# Altium project Kasli-DIOT.PrjPCB (part 6 of 7)

## Sheet CLK_buffer_DRTIO_CDR.SchDoc: Kasli-DIOT
size 420 x 297 mm; EDA_Number: EDA-04514-V3-0; Projet: DI/OT System Board; Author: G.Kasprowicz; CompanyName: WUT ISE; DrawnBy: F.Świtakowski; Organization: WUT ISE; Address1: PW ISE; Address2: Nowowiejska 15/19 00-665 Warsaw; Address3: gkasprow@gmail.com; DocumentNumber: 15; Revision: 1.0; SheetNumber: 12; SheetTotal: 16; ModifiedBy: -; CheckedDate: -; Title2: CLK buffer DRTIo; DivGrp: WUT ISE; Designer: F.Świtakowski; ModifiedDate: -; ProjectName: Sensor Box
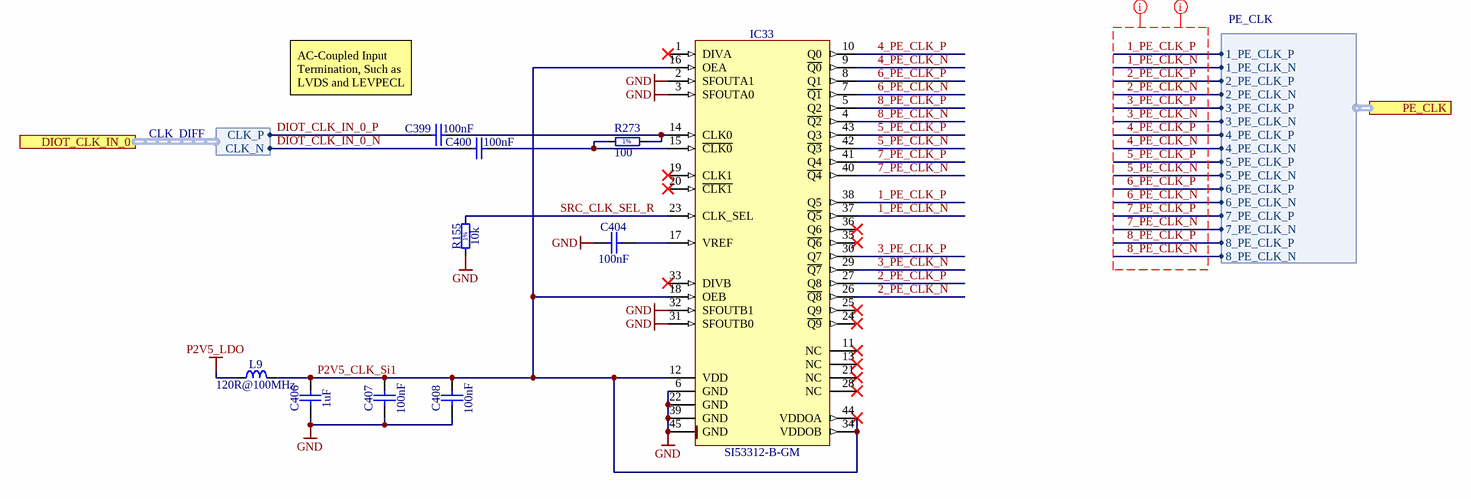
[diagram p8: CLK_buffer_DRTIO_CDR.SchDoc]

### Parts
C399  100nF  [CAPC0603X33N]
C400  100nF  [CAPC0603X33N]
C404  100nF  [CAPC1005X55N]
C406  1uF  [CAPC1608X87N]
C407  100nF  [CAPC1005X55N]
C408  100nF  [CAPC1005X55N]
IC33  SI53312-B-GM  [QFN50P700X700X90-45N-S295]
L9  120R@100MHz  [INDC1608X95N]
R155  10k  [RESC1005X40N]
R273  100  [RESC1005X40N]

### Ports
DIOT_CLK_IN_0 (harness CLK_DIFF), PE_CLK (harness PE_CLK)

### Harnesses
PE_CLK: 1_PE_CLK_P, 1_PE_CLK_N, 2_PE_CLK_P, 2_PE_CLK_N, 3_PE_CLK_P, 3_PE_CLK_N, 4_PE_CLK_P, 4_PE_CLK_N, 5_PE_CLK_P, 5_PE_CLK_N, 6_PE_CLK_P, 6_PE_CLK_N, 7_PE_CLK_P, 7_PE_CLK_N, 8_PE_CLK_P, 8_PE_CLK_N
CLK_DIFF: CLK_P, CLK_N

### Nets
GND: C404.1 C406.1 C407.1 C408.1 IC33.2(SFOUTA1) IC33.3(SFOUTA0) IC33.6(GND) IC33.22(GND) IC33.31(SFOUTB0) IC33.32(SFOUTB1) IC33.39(GND) IC33.45(GND) R155.1
P2V5_LDO: L9.2
1_PE_CLK_N: IC33.37(~{Q5}) ; port PE_CLK.1_PE_CLK_N
1_PE_CLK_P: IC33.38(Q5) ; port PE_CLK.1_PE_CLK_P
2_PE_CLK_N: IC33.26(~{Q8}) ; port PE_CLK.2_PE_CLK_N
2_PE_CLK_P: IC33.27(Q8) ; port PE_CLK.2_PE_CLK_P
3_PE_CLK_N: IC33.29(~{Q7}) ; port PE_CLK.3_PE_CLK_N
3_PE_CLK_P: IC33.30(Q7) ; port PE_CLK.3_PE_CLK_P
4_PE_CLK_N: IC33.9(~{Q0}) ; port PE_CLK.4_PE_CLK_N
4_PE_CLK_P: IC33.10(Q0) ; port PE_CLK.4_PE_CLK_P
5_PE_CLK_N: IC33.42(~{Q3}) ; port PE_CLK.5_PE_CLK_N
5_PE_CLK_P: IC33.43(Q3) ; port PE_CLK.5_PE_CLK_P
6_PE_CLK_N: IC33.7(~{Q1}) ; port PE_CLK.6_PE_CLK_N
6_PE_CLK_P: IC33.8(Q1) ; port PE_CLK.6_PE_CLK_P
7_PE_CLK_N: IC33.40(~{Q4}) ; port PE_CLK.7_PE_CLK_N
7_PE_CLK_P: IC33.41(Q4) ; port PE_CLK.7_PE_CLK_P
8_PE_CLK_N: IC33.4(~{Q2}) ; port PE_CLK.8_PE_CLK_N
8_PE_CLK_P: IC33.5(Q2) ; port PE_CLK.8_PE_CLK_P
DIOT_CLK_IN_0_N: C400.1 ; port DIOT_CLK_IN_0.CLK_N  [project net DIOT_CLK_IN_0.CLK_N]
DIOT_CLK_IN_0_P: C399.1 ; port DIOT_CLK_IN_0.CLK_P  [project net DIOT_CLK_IN_0.CLK_P]
P2V5_CLK_Si1: C406.2 C407.2 C408.2 IC33.12(VDD) IC33.16(OEA) IC33.18(OEB) IC33.34(VDDOB) IC33.44(VDDOA) L9.1
SRC_CLK_SEL_R: IC33.23(CLK_SEL) R155.2
NetC399_2: C399.2 IC33.14(CLK0) R273.2
NetC400_2: C400.2 IC33.15(~{CLK0}) R273.1
NetC404_2: C404.2 IC33.17(VREF)

Not connected (* = marked no-connect by the designer): IC33 1(DIVA)* 11(NC)* 13(NC)* 19(CLK1)* 20(~{CLK1})* 21(NC)* 24(~{Q9})* 25(Q9)* 28(NC)* 33(DIVB)* 35(~{Q6})* 36(Q6)*

### Layout directives
net class D100: 1_PE_CLK_N, 1_PE_CLK_P, 2_PE_CLK_N, 2_PE_CLK_P, 3_PE_CLK_N, 3_PE_CLK_P, 4_PE_CLK_N, 4_PE_CLK_P, 5_PE_CLK_N, 5_PE_CLK_P, 6_PE_CLK_N, 6_PE_CLK_P, 7_PE_CLK_N, 7_PE_CLK_P, 8_PE_CLK_N, 8_PE_CLK_P
net class PE_CLK: 1_PE_CLK_N, 1_PE_CLK_P, 2_PE_CLK_N, 2_PE_CLK_P, 3_PE_CLK_N, 3_PE_CLK_P, 4_PE_CLK_N, 4_PE_CLK_P, 5_PE_CLK_N, 5_PE_CLK_P, 6_PE_CLK_N, 6_PE_CLK_P, 7_PE_CLK_N, 7_PE_CLK_P, 8_PE_CLK_N, 8_PE_CLK_P

### Notes on the sheet
- (near C399) AC-Coupled Input Termination, Such as LVDS and LEVPECL
- Project/Equipment
- Document
- Designer
- Drawn by
- Check.by
- Copyright WUT ISE 2024.
  This documentation describes Open Hardware and is licensed under the CERN OHL-W v.2.0. You may redistribute and modify this documentation under the terms of the CERN OHL-W v.2.0. (http://ohwr.org/CERNOHL). This documentation is distributed WITHOUT ANY EXPRESS OR IMPLIED WARRANTY, INCLUDING OF MERCHANTABILITY, SATISFACTORY QUALITY AND FITNESS FOR A PARTICULAR PURPOSE. Please see the CERN OHL v.2.0 for applicable conditions.
- Contact
- File
- Last Mod.
- Print Date
- Sheet
- Size
- A3
- of
- Rev
- (in symbol R0402_10K_1%_0.0625W_100PPM) 1%
- (in symbol R0402_100R_1%_0.0625W_100PPM) 1%

### Library data of the parts
C399 C400 = CC0201_100NF_6.3V_10%_X5R: Non-polarised capacitor; Part Description: SMD Multilayer Chip Ceramic Capacitor; Manufacturer: GENERIC; Manufacturer1 Part Number: 02016D104KAT2A; Voltage: 6.3V; TC: X5R; Tolerance: ±10%; Part Number: CC0201_100NF_6.3V_10%_X5R; Component Kind: Standard; Component Type: Standard; Pin Count: 2; Value: 100nF; Status: Not Recommended; Manufacturer Part Number: CC0201_100NF_6.3V_10%_X5R; Case: 0201; Mounted: Yes; Socket: No; SMD: Yes; Sense: No; Manufacturer1 Example: AVX; Manufacturer1 ComponentHeight: 0.33mm; HelpURL: \\cern.ch\dfs\Applications\Altium\Datasheets\CC0201_X5R_AVX.pdf; Author: CERN DEM JLC; CreateDate: 03.12.2007; LatestRevisionDate: 03.12.2007
C404 C407 C408 = CC0402_100NF_16V_10%_X7R: as C213-C224 on sheet USB_Serial_Quad; Part Number: CC0402_100NF_16V_10%_X7R; Component Kind: Standard; Component Type: Standard; Pin Count: 2; Value: 100nF; Status: Not Recommended; Manufacturer Part Number: CC0402_100NF_16V_10%_X7R; Case: 0402; Mounted: Yes; Socket: No; SMD: Yes; Sense: No; Manufacturer1 Example: MURATA; Manufacturer1 ComponentHeight: 0.55mm; HelpURL: \\cern.ch\dfs\Applications\Altium\Datasheets\CC0402_X7R_MURATA_GRM.pdf; Author: CERN DEM JLC; CreateDate: 05/12/2013; LatestRevisionDate: 03/12/2007
C406 = CC0603_1UF_25V_10%_X7R: Non-polarised capacitor; Part Description: SMD Multilayer Chip Ceramic Capacitor; Manufacturer: GENERIC; Manufacturer1 Part Number: GRM188R71E105KA12D; Voltage: 25V; TC: X7R; Tolerance: ±10%; Part Number: CC0603_1UF_25V_10%_X7R; Component Kind: Standard; Component Type: Standard; Pin Count: 2; Value: 1uF; Status: None; Manufacturer Part Number: CC0603_1UF_25V_10%_X7R; Case: 0603; Mounted: Yes; Socket: No; SMD: Yes; Sense: No; Manufacturer1 Example: MURATA; Manufacturer1 ComponentHeight: 0.9mm; HelpURL: \\cern.ch\dfs\Applications\Altium\Datasheets\CC0603_X7R_MURATA.pdf; Author: CERN DEM JLC; CreateDate: 18.01.2011; LatestRevisionDate: 18.01.2011
IC33 = SI53312-B-GM: 2 Input/10 Output, Low Jitter Universal Buffer/Level Translator With 2:1 Input Mux (<1.25 GHZ); Manufacturer: SILICON LABS; PressFit: No; Bonding: No; Part Number: SI53312-B-GM; Component Kind: Standard; Component Type: Standard; Device: SI53312-B-GM; PackageDescription: QFN, 0.50mm Pitch, Square; 44 Pin, 7.00mm L X 7.00mm W X 0.90mm H body (w/Thermal Tab 2.95 X 2.95mm), IPC Medium Density; Part Description: 2 Input/10 Output, Low Jitter Universal Buffer/Level Translator With 2:1 Input Mux (<1.25 GHZ); Manufacturer Part Number: SI53312-B-GM; Pin Count: 45; Case: QFN44; Mounted: Yes; Socket: No; SMD: Yes; Sense: No; ComponentHeight: 0.9mm; Author: CERN DEM MR; HelpURL: \\cern.ch\dfs\Applications\Altium\Datasheets\SI53312-B-GM.pdf; CreateDate: 02.10.2017; LatestRevisionDate: 02.10.2017
L9 = IND0603_MURATA_BLM18PG121SN1D: Inductor; Part Description: SMD EMIFIL Chip Ferrite Bead; Manufacturer: MURATA; Power: 2A; Resistance: 0.05R; Part Number: IND0603_MURATA_BLM18PG121SN1D; Component Kind: Standard; Component Type: Standard; Pin Count: 2; Value: 120R@100MHz; Status: None; Manufacturer Part Number: BLM18PG121SN1D; Case: 0603; Mounted: Yes; Socket: No; SMD: Yes; Sense: No; ComponentHeight: 0.95mm; HelpURL: \\cern.ch\dfs\Applications\Altium\Datasheets\IND0603_MURATA_BLM18P.pdf; Author: CERN DEM BC; CreateDate: 2015-07-27; LatestRevisionDate: 2015-07-27
R155 = R0402_10K_1%_0.0625W_100PPM: as R194-R198 on sheet USB_Serial_Quad; Part Number: R0402_10K_1%_0.0625W_100PPM; Component Kind: Standard; Component Type: Standard; Pin Count: 2; Value: 10k; Status: Not Recommended; Power: 0.0625W; Tolerance: ±1%; Manufacturer Part Number: R0402_10K_1%_0.0625W_100PPM; Case: 0402; Mounted: Yes; Sense: No; Socket: No; SMD: Yes; Manufacturer1 Example: YAGEO PHYCOMP; Manufacturer1 ComponentHeight: 0.4mm; HelpURL: \\cern.ch\dfs\Applications\Altium\Datasheets\R0402_Phycomp_RC0402.pdf; Author: CERN DEM JLC; CreateDate: 03.12.2007; LatestRevisionDate: 17.10.2012
R273 = R0402_100R_1%_0.0625W_100PPM: Resistor - 1%; Part Description: General Purpose Thick Film Chip Resistor; Manufacturer: GENERIC; Manufacturer1 Part Number: 232270671001L; TC: ±100ppm/°C; PressFit: No; Part Number: R0402_100R_1%_0.0625W_100PPM; Component Kind: Standard; Component Type: Standard; Pin Count: 2; Value: 100; Status: Not Recommended; Power: 0.0625W; Tolerance: ±1%; Manufacturer Part Number: R0402_100R_1%_0.0625W_100PPM; Case: 0402; Mounted: Yes; Sense: No; Socket: No; SMD: Yes; Manufacturer1 Example: YAGEO PHYCOMP; Manufacturer1 ComponentHeight: 0.4mm; HelpURL: \\cern.ch\dfs\Applications\Altium\Datasheets\R0402_Phycomp_RC0402.pdf; Author: CERN DEM JLC; CreateDate: 03.12.2007; LatestRevisionDate: 17.10.2012

## Sheet Ext_conn.schdoc: Kasli-DIOT
size 420 x 297 mm; EDA_Number: ARTIQ; Projet: ARTIQ/SINARA; Author: G.Kasprowicz; CompanyName: WUT ISE; DrawnBy: F.Świtakowski; Organization: WUT ISE; Address1: PW ISE; Address2: Nowowiejska 15/19 00-665 Warsaw; Address3: gkasprow@gmail.com; DocumentNumber: 16; Revision: 1.0; SheetNumber: 13; SheetTotal: 16; ModifiedBy: -; CheckedDate: -; Title2: Ext conn; DivGrp: WUT ISE; Designer: F.Świtakowski; ModifiedDate: -; ProjectName: Sensor Box
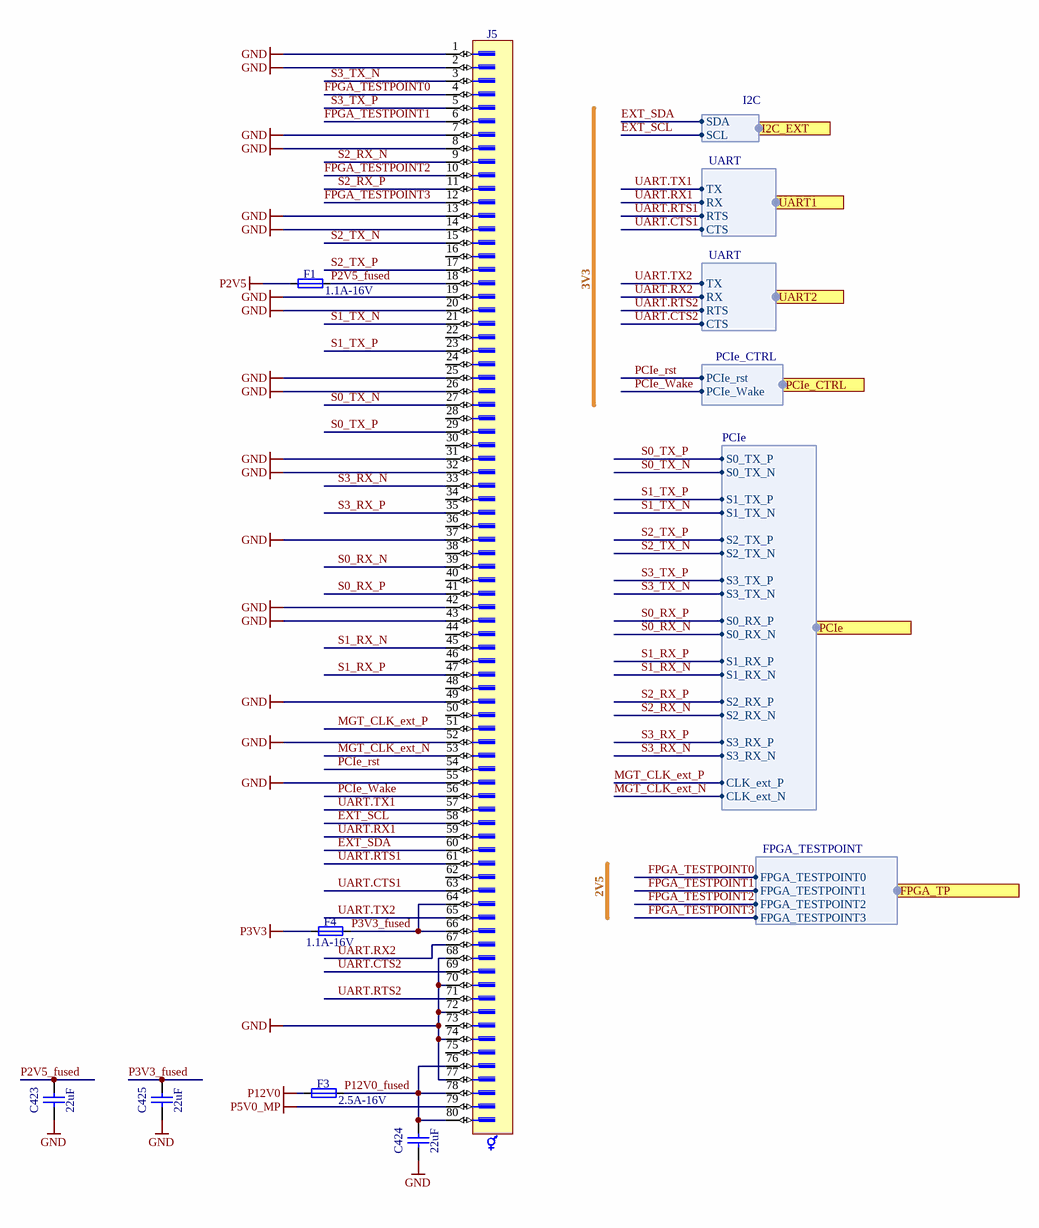
[diagram p9: Ext_conn.schdoc]

### Parts
C423  22uF  [CAPC2012X135N]
C424  22uF  [CAPC2012X135N]
C425  22uF  [CAPC2012X135N]
F1  1.1A-16V  [FUSR_BOURNS_MF-MSMF_STYLE1(H85)]
F3  2.5A-16V  [FUSR_BOURNS_MF-MSMF_STYLE2]
F4  1.1A-16V  [FUSR_BOURNS_MF-MSMF_STYLE1(H85)]
J5  (no value)  [SAMTEC_LSS-140-01-L-DV-A]

### Ports
FPGA_TP (harness FPGA_TESTPOINT), I2C_EXT (harness i2C), PCIe (harness PCIe), PCIe_CTRL (harness PCIe_CTRL), UART1 (harness UART), UART2 (harness UART)

### Harnesses
UART: TX, RX, RTS, CTS
PCIe_CTRL: PCIe_rst, PCIe_Wake
PCIe: S0_TX_P, S0_TX_N, S1_TX_P, S1_TX_N, S2_TX_P, S2_TX_N, S3_TX_P, S3_TX_N, S0_RX_P, S0_RX_N, S1_RX_P, S1_RX_N, S2_RX_P, S2_RX_N, S3_RX_P, S3_RX_N, CLK_ext_P, CLK_ext_N
FPGA_TESTPOINT: FPGA_TESTPOINT0, FPGA_TESTPOINT1, FPGA_TESTPOINT2, FPGA_TESTPOINT3
I2C: SDA, SCL

### Nets
GND: C423.1 C424.1 C425.1 J5.1 J5.2 J5.7 J5.8 J5.13 J5.14 J5.19 J5.20 J5.25 J5.26 J5.31 J5.32 J5.37 J5.42 J5.43 J5.49 J5.52 J5.55 J5.68 J5.70 J5.72 J5.74 J5.77
P2V5: F1.1
P3V3: F4.1
P5V0_MP: J5.79
P12V0: F3.1
EXT_SCL: J5.58 ; port I2C_EXT.SCL
EXT_SDA: J5.60 ; port I2C_EXT.SDA
FPGA_TESTPOINT0: J5.4 ; port FPGA_TP.FPGA_TESTPOINT0
FPGA_TESTPOINT1: J5.6 ; port FPGA_TP.FPGA_TESTPOINT1
FPGA_TESTPOINT2: J5.10 ; port FPGA_TP.FPGA_TESTPOINT2
FPGA_TESTPOINT3: J5.12 ; port FPGA_TP.FPGA_TESTPOINT3
MGT_CLK_ext_N: J5.53 ; port PCIe.CLK_ext_N
MGT_CLK_ext_P: J5.51 ; port PCIe.CLK_ext_P
P2V5_fused: C423.2 F1.2 J5.18
P3V3_fused: C425.2 F4.2 J5.64 J5.66
P12V0_fused: C424.2 F3.2 J5.76 J5.78 J5.80
PCIe_rst: J5.54 ; port PCIe_CTRL.PCIe_rst
PCIe_Wake: J5.56 ; port PCIe_CTRL.PCIe_Wake
S0_RX_N: J5.39 ; port PCIe.S0_RX_N
S0_RX_P: J5.41 ; port PCIe.S0_RX_P
S0_TX_N: J5.27 ; port PCIe.S0_TX_N
S0_TX_P: J5.29 ; port PCIe.S0_TX_P
S1_RX_N: J5.45 ; port PCIe.S1_RX_N
S1_RX_P: J5.47 ; port PCIe.S1_RX_P
S1_TX_N: J5.21 ; port PCIe.S1_TX_N
S1_TX_P: J5.23 ; port PCIe.S1_TX_P
S2_RX_N: J5.9 ; port PCIe.S2_RX_N
S2_RX_P: J5.11 ; port PCIe.S2_RX_P
S2_TX_N: J5.15 ; port PCIe.S2_TX_N
S2_TX_P: J5.17 ; port PCIe.S2_TX_P
S3_RX_N: J5.33 ; port PCIe.S3_RX_N
S3_RX_P: J5.35 ; port PCIe.S3_RX_P
S3_TX_N: J5.3 ; port PCIe.S3_TX_N
S3_TX_P: J5.5 ; port PCIe.S3_TX_P
UART.CTS1: J5.63 ; port UART1.CTS
UART.CTS2: J5.69 ; port UART2.CTS
UART.RTS1: J5.61 ; port UART1.RTS
UART.RTS2: J5.71 ; port UART2.RTS
UART.RX1: J5.59 ; port UART1.RX
UART.RX2: J5.67 ; port UART2.RX
UART.TX1: J5.57 ; port UART1.TX
UART.TX2: J5.65 ; port UART2.TX

Not connected (* = marked no-connect by the designer): J5 16 22 24 28 30 34 36 38 40 44 46 48 50 62 73 75

### Notes on the sheet
- 3V3
- 2V5
- Project/Equipment
- Document
- Designer
- Drawn by
- Check.by
- Copyright WUT ISE 2024.
  This documentation describes Open Hardware and is licensed under the CERN OHL-W v.2.0. You may redistribute and modify this documentation under the terms of the CERN OHL-W v.2.0. (http://ohwr.org/CERNOHL). This documentation is distributed WITHOUT ANY EXPRESS OR IMPLIED WARRANTY, INCLUDING OF MERCHANTABILITY, SATISFACTORY QUALITY AND FITNESS FOR A PARTICULAR PURPOSE. Please see the CERN OHL v.2.0 for applicable conditions.
- Contact
- File
- Last Mod.
- Print Date
- Sheet
- Size
- A3
- of
- Rev

### Library data of the parts
C423-C425 = CC0805_22UF_16V_10%_X5R: Non-polarised capacitor; Manufacturer: GENERIC; Part Description: SMD Multilayer Chip Ceramic Capacitor; Manufacturer1 Part Number: C2012X5R1C226KT; Tolerance: ±10%; Voltage: 16V; TC: X5R; Manufacturer Part Number: CC0805_22UF_16V_10%_X5R; Part Number: CC0805_22UF_16V_10%_X5R; Value: 22uF; Component Kind: Standard; Component Type: Standard; Pin Count: 2; Status: Preferred; Case: 0805; Mounted: Yes; Socket: No; SMD: Yes; Sense: No; Manufacturer1 Example: TDK; Manufacturer1 ComponentHeight: 1.35mm; HelpURL: \\cern.ch\dfs\Applications\Altium\Datasheets\CC0805_X5R_TDK_C.pdf; Author: CERN DEM JLC; CreateDate: 25.10.2012; LatestRevisionDate: 25.10.2012
F1 F4 = FUSR_BOURNS_MF-MSMF110/16-2: Fuse; Part Description: PTC Resettable Fuse; Manufacturer: BOURNS; PressFit: No; Part Number: FUSR_BOURNS_MF-MSMF110/16-2; Component Kind: Standard; Component Type: Standard; Pin Count: 2; PackageDescription: PTC Resettable Fuse, MF-MSMS Series, Case Style 1 Height 0.85mm; Family: Fuses Resettable; Mounted: Yes; Socket: No; SMD: Yes; Sense: No; Value: 1.1A-16V; Manufacturer Part Number: MF-MSMF110/16; ComponentHeight: 0.85mm; HelpURL: \\cern.ch\dfs\Applications\Altium\Datasheets\FUSR_BOURNS_MF-MSMF.pdf; Author: CERN DEM JLC; CreateDate: 02.03.2011; LatestRevisionDate: 20.06.2023
F3 = FUSR_BOURNS_MF-MSMF250/16X-2: Fuse; Part Description: PTC Resettable Fuse; Manufacturer: BOURNS; PressFit: No; Part Number: FUSR_BOURNS_MF-MSMF250/16X-2; Component Kind: Standard; Component Type: Standard; Pin Count: 2; PackageDescription: PTC Resettable Fuse, MF-MSMS Series, Case Style 2; Family: Fuses Resettable; Mounted: Yes; Socket: No; SMD: Yes; Sense: No; Value: 2.5A-16V; Manufacturer Part Number: MF-MSMF250/16X; ComponentHeight: 1.6mm; HelpURL: \\cern.ch\dfs\Applications\Altium\Datasheets\FUSR_BOURNS_MF-MSMF.pdf; Author: CERN DEM JLC; CreateDate: 02.03.2011; LatestRevisionDate: 20.06.2023
J5 = SAMTEC_LSS-140-01-L-DV-A: Connector 80 Hermaphroditic; Part Description: 80 Contacts, Pitch 0.635mm, Razor Beam LSS Vertical High Speed Hermaphroditic Strip (Lead Style 4.5mm); Manufacturer: SAMTEC; PressFit: No; Part Number: SAMTEC_LSS-140-01-L-DV-A; Component Kind: Standard; Component Type: Standard; Pin Count: 80; Mounted: Yes; Socket: No; SMD: Yes; Sense: No; Status: None; Manufacturer Part Number: LSS-140-01-L-DV-A; ComponentHeight: 4.57mm; HelpURL: \\cern.ch\dfs\Applications\Altium\Datasheets\SAMTEC_LSS-140-01-L-DV-A.pdf; Author: CERN DEM JMW; CreateDate: 10.11.2015; LatestRevisionDate: 10.11.2015

## Sheet Bank_13_15.SchDoc: Kasli-DIOT
size 420 x 297 mm; EDA_Number: ARTIQ; Projet: ARTIQ/SINARA; Author: G.Kasprowicz; CompanyName: WUT ISE; DrawnBy: F.Świtakowski; Organization: WUT ISE; Address1: PW ISE; Address2: Nowowiejska 15/19 00-665 Warsaw; Address3: gkasprow@gmail.com; DocumentNumber: 13; Revision: 1.0; SheetNumber: 16; SheetTotal: 16; ModifiedBy: -; CheckedDate: -; Title2: Bank 13 15; DivGrp: WUT ISE; Designer: F.Świtakowski; ModifiedDate: -; ProjectName: Sensor Box
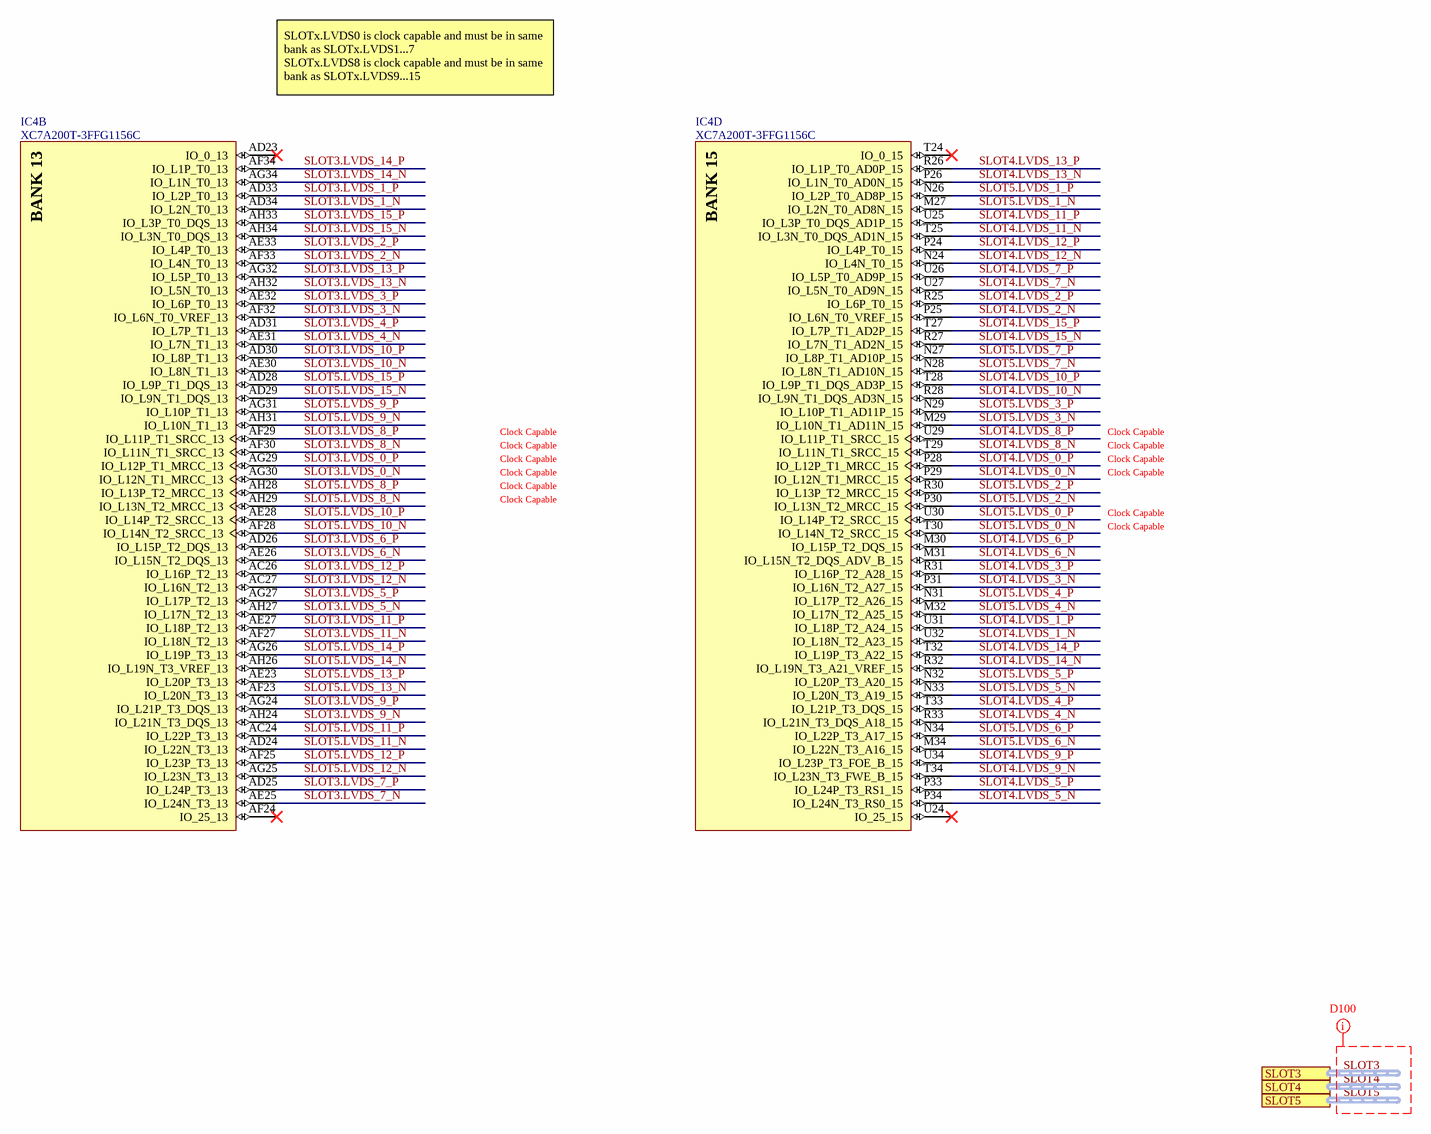
[diagram p10: Bank_13_15.SchDoc]

### Parts
IC4  XC7A200T-3FFG1156C  [BGA1156C100P34X34_3500X3500X310]  (parts B,D of 18)

### Ports
SLOT3 (harness SLOT), SLOT4 (harness SLOT), SLOT5 (harness SLOT)

### Nets
SLOT3.LVDS_0_N: IC4.AG30(IO_L12N_T1_MRCC_13)
SLOT3.LVDS_0_P: IC4.AG29(IO_L12P_T1_MRCC_13)
SLOT3.LVDS_1_N: IC4.AD34(IO_L2N_T0_13)
SLOT3.LVDS_1_P: IC4.AD33(IO_L2P_T0_13)
SLOT3.LVDS_2_N: IC4.AF33(IO_L4N_T0_13)
SLOT3.LVDS_2_P: IC4.AE33(IO_L4P_T0_13)
SLOT3.LVDS_3_N: IC4.AF32(IO_L6N_T0_VREF_13)
SLOT3.LVDS_3_P: IC4.AE32(IO_L6P_T0_13)
SLOT3.LVDS_4_N: IC4.AE31(IO_L7N_T1_13)
SLOT3.LVDS_4_P: IC4.AD31(IO_L7P_T1_13)
SLOT3.LVDS_5_N: IC4.AH27(IO_L17N_T2_13)
SLOT3.LVDS_5_P: IC4.AG27(IO_L17P_T2_13)
SLOT3.LVDS_6_N: IC4.AE26(IO_L15N_T2_DQS_13)
SLOT3.LVDS_6_P: IC4.AD26(IO_L15P_T2_DQS_13)
SLOT3.LVDS_7_N: IC4.AE25(IO_L24N_T3_13)
SLOT3.LVDS_7_P: IC4.AD25(IO_L24P_T3_13)
SLOT3.LVDS_8_N: IC4.AF30(IO_L11N_T1_SRCC_13)
SLOT3.LVDS_8_P: IC4.AF29(IO_L11P_T1_SRCC_13)
SLOT3.LVDS_9_N: IC4.AH24(IO_L21N_T3_DQS_13)
SLOT3.LVDS_9_P: IC4.AG24(IO_L21P_T3_DQS_13)
SLOT3.LVDS_10_N: IC4.AE30(IO_L8N_T1_13)
SLOT3.LVDS_10_P: IC4.AD30(IO_L8P_T1_13)
SLOT3.LVDS_11_N: IC4.AF27(IO_L18N_T2_13)
SLOT3.LVDS_11_P: IC4.AE27(IO_L18P_T2_13)
SLOT3.LVDS_12_N: IC4.AC27(IO_L16N_T2_13)
SLOT3.LVDS_12_P: IC4.AC26(IO_L16P_T2_13)
SLOT3.LVDS_13_N: IC4.AH32(IO_L5N_T0_13)
SLOT3.LVDS_13_P: IC4.AG32(IO_L5P_T0_13)
SLOT3.LVDS_14_N: IC4.AG34(IO_L1N_T0_13)
SLOT3.LVDS_14_P: IC4.AF34(IO_L1P_T0_13)
SLOT3.LVDS_15_N: IC4.AH34(IO_L3N_T0_DQS_13)
SLOT3.LVDS_15_P: IC4.AH33(IO_L3P_T0_DQS_13)
SLOT4.LVDS_0_N: IC4.P29(IO_L12N_T1_MRCC_15)
SLOT4.LVDS_0_P: IC4.P28(IO_L12P_T1_MRCC_15)
SLOT4.LVDS_1_N: IC4.U32(IO_L18N_T2_A23_15)
SLOT4.LVDS_1_P: IC4.U31(IO_L18P_T2_A24_15)
SLOT4.LVDS_2_N: IC4.P25(IO_L6N_T0_VREF_15)
SLOT4.LVDS_2_P: IC4.R25(IO_L6P_T0_15)
SLOT4.LVDS_3_N: IC4.P31(IO_L16N_T2_A27_15)
SLOT4.LVDS_3_P: IC4.R31(IO_L16P_T2_A28_15)
SLOT4.LVDS_4_N: IC4.R33(IO_L21N_T3_DQS_A18_15)
SLOT4.LVDS_4_P: IC4.T33(IO_L21P_T3_DQS_15)
SLOT4.LVDS_5_N: IC4.P34(IO_L24N_T3_RS0_15)
SLOT4.LVDS_5_P: IC4.P33(IO_L24P_T3_RS1_15)
SLOT4.LVDS_6_N: IC4.M31(IO_L15N_T2_DQS_ADV_B_15)
SLOT4.LVDS_6_P: IC4.M30(IO_L15P_T2_DQS_15)
SLOT4.LVDS_7_N: IC4.U27(IO_L5N_T0_AD9N_15)
SLOT4.LVDS_7_P: IC4.U26(IO_L5P_T0_AD9P_15)
SLOT4.LVDS_8_N: IC4.T29(IO_L11N_T1_SRCC_15)
SLOT4.LVDS_8_P: IC4.U29(IO_L11P_T1_SRCC_15)
SLOT4.LVDS_9_N: IC4.T34(IO_L23N_T3_FWE_B_15)
SLOT4.LVDS_9_P: IC4.U34(IO_L23P_T3_FOE_B_15)
SLOT4.LVDS_10_N: IC4.R28(IO_L9N_T1_DQS_AD3N_15)
SLOT4.LVDS_10_P: IC4.T28(IO_L9P_T1_DQS_AD3P_15)
SLOT4.LVDS_11_N: IC4.T25(IO_L3N_T0_DQS_AD1N_15)
SLOT4.LVDS_11_P: IC4.U25(IO_L3P_T0_DQS_AD1P_15)
SLOT4.LVDS_12_N: IC4.N24(IO_L4N_T0_15)
SLOT4.LVDS_12_P: IC4.P24(IO_L4P_T0_15)
SLOT4.LVDS_13_N: IC4.P26(IO_L1N_T0_AD0N_15)
SLOT4.LVDS_13_P: IC4.R26(IO_L1P_T0_AD0P_15)
SLOT4.LVDS_14_N: IC4.R32(IO_L19N_T3_A21_VREF_15)
SLOT4.LVDS_14_P: IC4.T32(IO_L19P_T3_A22_15)
SLOT4.LVDS_15_N: IC4.R27(IO_L7N_T1_AD2N_15)
SLOT4.LVDS_15_P: IC4.T27(IO_L7P_T1_AD2P_15)
SLOT5.LVDS_0_N: IC4.T30(IO_L14N_T2_SRCC_15)
SLOT5.LVDS_0_P: IC4.U30(IO_L14P_T2_SRCC_15)
SLOT5.LVDS_1_N: IC4.M27(IO_L2N_T0_AD8N_15)
SLOT5.LVDS_1_P: IC4.N26(IO_L2P_T0_AD8P_15)
SLOT5.LVDS_2_N: IC4.P30(IO_L13N_T2_MRCC_15)
SLOT5.LVDS_2_P: IC4.R30(IO_L13P_T2_MRCC_15)
SLOT5.LVDS_3_N: IC4.M29(IO_L10N_T1_AD11N_15)
SLOT5.LVDS_3_P: IC4.N29(IO_L10P_T1_AD11P_15)
SLOT5.LVDS_4_N: IC4.M32(IO_L17N_T2_A25_15)
SLOT5.LVDS_4_P: IC4.N31(IO_L17P_T2_A26_15)
SLOT5.LVDS_5_N: IC4.N33(IO_L20N_T3_A19_15)
SLOT5.LVDS_5_P: IC4.N32(IO_L20P_T3_A20_15)
SLOT5.LVDS_6_N: IC4.M34(IO_L22N_T3_A16_15)
SLOT5.LVDS_6_P: IC4.N34(IO_L22P_T3_A17_15)
SLOT5.LVDS_7_N: IC4.N28(IO_L8N_T1_AD10N_15)
SLOT5.LVDS_7_P: IC4.N27(IO_L8P_T1_AD10P_15)
SLOT5.LVDS_8_N: IC4.AH29(IO_L13N_T2_MRCC_13)
SLOT5.LVDS_8_P: IC4.AH28(IO_L13P_T2_MRCC_13)
SLOT5.LVDS_9_N: IC4.AH31(IO_L10N_T1_13)
SLOT5.LVDS_9_P: IC4.AG31(IO_L10P_T1_13)
SLOT5.LVDS_10_N: IC4.AF28(IO_L14N_T2_SRCC_13)
SLOT5.LVDS_10_P: IC4.AE28(IO_L14P_T2_SRCC_13)
SLOT5.LVDS_11_N: IC4.AD24(IO_L22N_T3_13)
SLOT5.LVDS_11_P: IC4.AC24(IO_L22P_T3_13)
SLOT5.LVDS_12_N: IC4.AG25(IO_L23N_T3_13)
SLOT5.LVDS_12_P: IC4.AF25(IO_L23P_T3_13)
SLOT5.LVDS_13_N: IC4.AF23(IO_L20N_T3_13)
SLOT5.LVDS_13_P: IC4.AE23(IO_L20P_T3_13)
SLOT5.LVDS_14_N: IC4.AH26(IO_L19N_T3_VREF_13)
SLOT5.LVDS_14_P: IC4.AG26(IO_L19P_T3_13)
SLOT5.LVDS_15_N: IC4.AD29(IO_L9N_T1_DQS_13)
SLOT5.LVDS_15_P: IC4.AD28(IO_L9P_T1_DQS_13)

Not connected (* = marked no-connect by the designer): IC4 AD23(IO_0_13)* AF24(IO_25_13)* T24(IO_0_15)* U24(IO_25_15)*

### Buses and harness runs
harness SLOT3 = port SLOT3
harness SLOT4 = port SLOT4
harness SLOT5 = port SLOT5

### Layout directives
net class D100: SLOT3, SLOT4, SLOT5

### Notes on the sheet
- SLOTx.LVDS0 is clock capable and must be in same bank as SLOTx.LVDS1...7
  SLOTx.LVDS8 is clock capable and must be in same bank as SLOTx.LVDS9...15
- Clock Capable
- Project/Equipment
- Document
- Designer
- Drawn by
- Check.by
- Copyright WUT ISE 2024.
  This documentation describes Open Hardware and is licensed under the CERN OHL-W v.2.0. You may redistribute and modify this documentation under the terms of the CERN OHL-W v.2.0. (http://ohwr.org/CERNOHL). This documentation is distributed WITHOUT ANY EXPRESS OR IMPLIED WARRANTY, INCLUDING OF MERCHANTABILITY, SATISFACTORY QUALITY AND FITNESS FOR A PARTICULAR PURPOSE. Please see the CERN OHL v.2.0 for applicable conditions.
- Contact
- File
- Last Mod.
- Print Date
- Sheet
- Size
- A3
- of
- Rev
- (in symbol XC7A200T-3FFG1156C, part B) BANK 13
- (in symbol XC7A200T-3FFG1156C, part D) BANK 15

### Library data of the parts
IC4 = XC7A200T-3FFG1156C: Artix-7 FPGA, 500 User I/Os, 16 GTP, 1156-Ball BGA, , Speed Grade 3, Commercial Grade, Pb-Free; Part Description: Artix-7 FPGA, 500 User I/Os, 16 GTP, 1156-Ball BGA, Speed Grade 3, Commercial Grade, Pb-Free; Manufacturer: XILINX; PressFit: No; Bonding: No; Part Number: XC7A200T-3FFG1156C; Component Kind: Standard; Component Type: Standard; Device: XC7A200T-3FFG1156C; PackageDescription: BGA, 1.00mm Pitch, Square; 1156 Pin, 34 Columns X 34 Rows, Body 35.00mm X 35.0mm X 3.10mm H, IPC Medium Density; Manufacturer Part Number: XC7A200T-3FFG1156C; Pin Count: 1156; Case: BGA1156; Mounted: Yes; Socket: No; SMD: Yes; Sense: No; ComponentHeight: 3.1mm; HelpURL: \\cern.ch\dfs\Applications\Altium\Datasheets\XC7A200T-3FFG1156C.pdf; ComponentLink1URL: \\cern.ch\dfs\Applications\Altium\Datasheets\XC7A200T-3FFG1156C_Package.pdf; ComponentLink1Description: Package; ComponentLink2URL: \\cern.ch\dfs\Applications\Altium\Datasheets\XC7A200T-3FFG1156C_Pinout.txt; ComponentLink2Description: Pinout; Author: CERN DEM JLC; CreateDate: 07.11.2016; LatestRevisionDate: 07.11.2016

## Sheet Bank_16_32_36.SchDoc: Kasli-DIOT
size 420 x 297 mm; EDA_Number: ARTIQ; Projet: ARTIQ/SINARA; Author: G.Kasprowicz; CompanyName: WUT ISE; DrawnBy: F.Świtakowski; Organization: WUT ISE; Address1: PW ISE; Address2: Nowowiejska 15/19 00-665 Warsaw; Address3: gkasprow@gmail.com; DocumentNumber: 14; Revision: 1.0; SheetNumber: 17; SheetTotal: 16; ModifiedBy: -; CheckedDate: -; Title2: Bank 16 32 36; DivGrp: WUT ISE; Designer: F.Świtakowski; ModifiedDate: -; ProjectName: Sensor Box
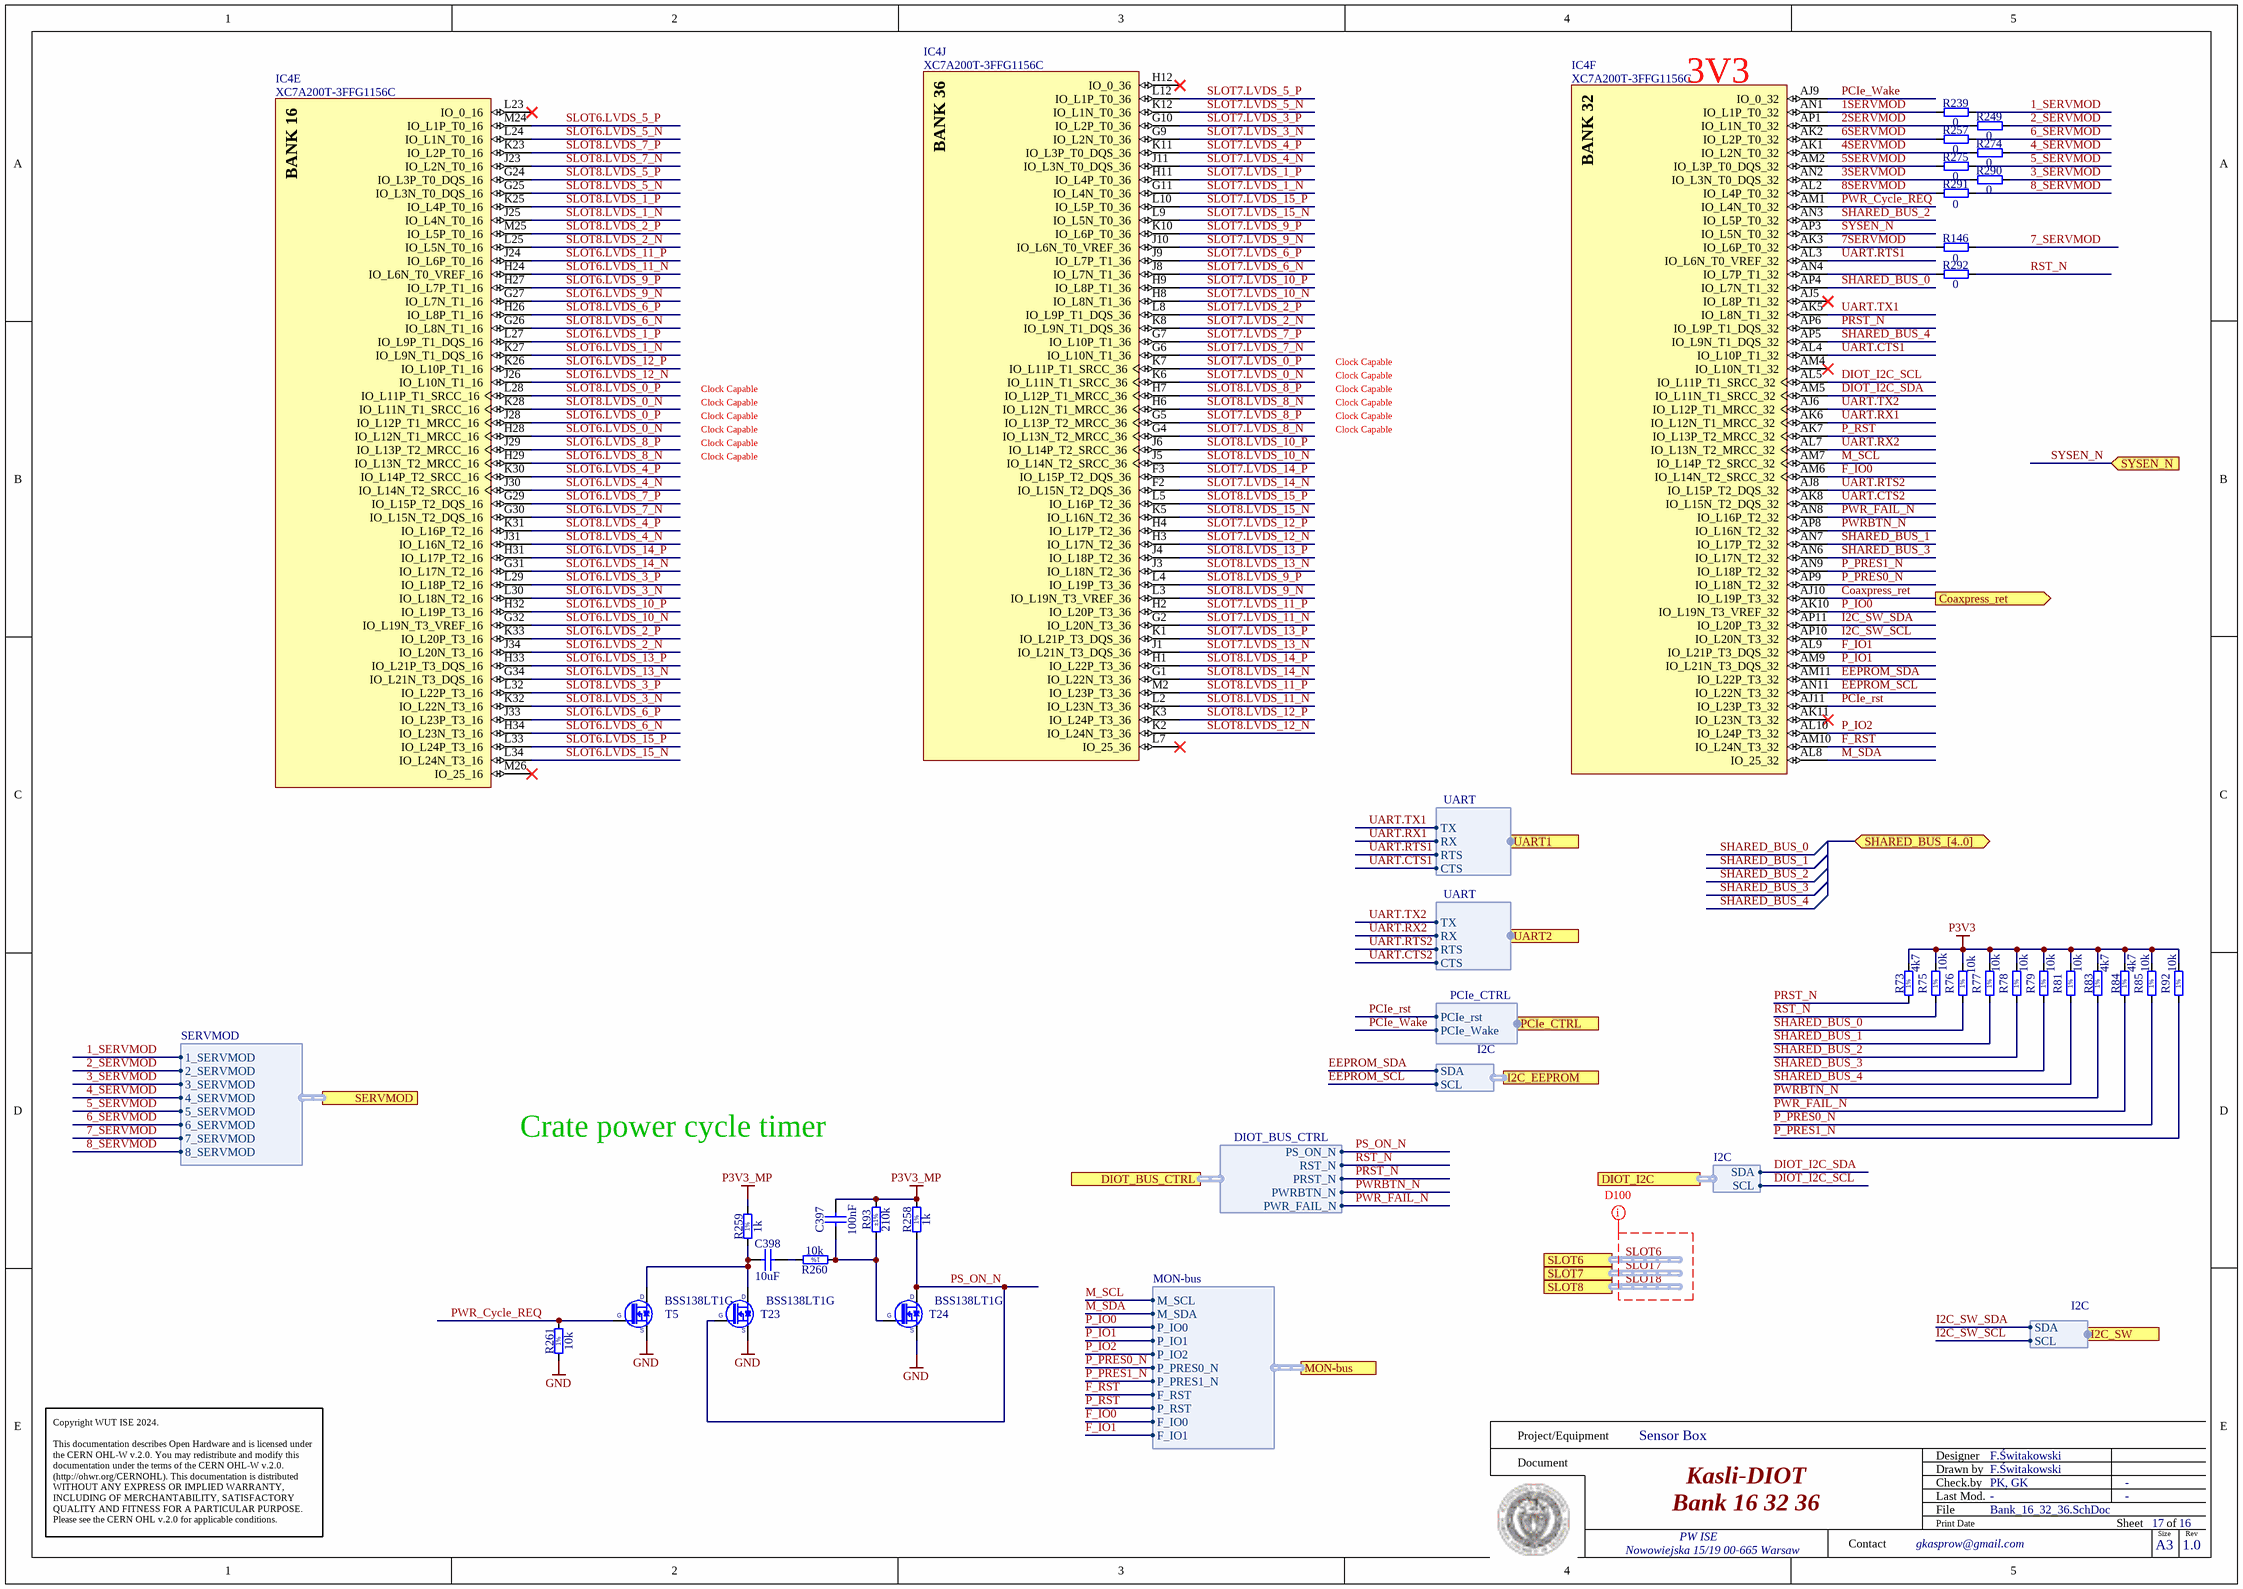
[diagram p11: Bank_16_32_36.SchDoc]

### Parts
C397  100nF  [CAPC1005X55N]
C398  10uF  [CAPC3216X180N]
IC4  XC7A200T-3FFG1156C  [BGA1156C100P34X34_3500X3500X310]  (parts E,F,J of 18)
R73  4k7  [RESC1005X40N]
R75  10k  [RESC1005X40N]
R76  10k  [RESC1005X40N]
R77  10k  [RESC1005X40N]
R78  10k  [RESC1005X40N]
R79  10k  [RESC1005X40N]
R81  10k  [RESC1005X40N]
R83  4k7  [RESC1005X40N]
R84  4k7  [RESC1005X40N]
R85  10k  [RESC1005X40N]
R92  10k  [RESC1005X40N]
R93  210k  Tolerance: ±1%  [RESC1005X40N]
R146  0  [RESC1005X40N]
R239  0  [RESC1005X40N]
R249  0  [RESC1005X40N]
R257  0  [RESC1005X40N]
R258  1k  [RESC1005X40N]
R259  1k  [RESC1005X40N]
R260  10k  [RESC1005X40N]
R261  10k  [RESC1005X40N]
R274  0  [RESC1005X40N]
R275  0  [RESC1005X40N]
R290  0  [RESC1005X40N]
R291  0  [RESC1005X40N]
R292  0  [RESC1005X40N]
T5  BSS138LT1G  [SOT95P240X110-3N]
T23  BSS138LT1G  [SOT95P240X110-3N]
T24  BSS138LT1G  [SOT95P240X110-3N]

### Ports
Coaxpress_ret (out), DIOT_BUS_CTRL (harness DIOT_BUS_CTRL), DIOT_I2C (harness I2C), I2C_EEPROM (harness I2C), I2C_SW (harness i2C), MON-bus (harness MON-bus), PCIe_CTRL (harness PCIe_CTRL), SERVMOD (harness SERVMOD), SHARED_BUS_[4..0] (bidir), SLOT6 (harness SLOT), SLOT7 (harness SLOT), SLOT8 (harness SLOT), SYSEN_N (in), UART1 (harness UART), UART2 (harness UART)

### Harnesses
DIOT_BUS_CTRL: PS_ON_N, RST_N, PRST_N, PWRBTN_N, PWR_FAIL_N
I2C: SDA, SCL
SERVMOD: 5_SERVMOD, 6_SERVMOD, 2_SERVMOD, 7_SERVMOD, 3_SERVMOD, 4_SERVMOD, 1_SERVMOD, 8_SERVMOD
MON-bus: M_SCL, M_SDA, P_IO0, P_IO1, P_IO2, P_PRES0_N, P_PRES1_N, F_RST, P_RST, F_IO0, F_IO1
UART: TX, RX, RTS, CTS
PCIe_CTRL: PCIe_rst, PCIe_Wake

### Nets
GND: R261.1 T5.2(S) T23.2(S) T24.2(S)
P3V3: R73.2 R75.2 R76.2 R77.2 R78.2 R79.2 R81.2 R83.2 R84.2 R85.2 R92.2
P3V3_MP: C397.2 R93.2 R258.2 R259.2
1_SERVMOD: R239.2 ; port SERVMOD.1_SERVMOD
1SERVMOD: IC4.AN1(IO_L1P_T0_32) R239.1
2_SERVMOD: R249.2 ; port SERVMOD.2_SERVMOD
2SERVMOD: IC4.AP1(IO_L1N_T0_32) R249.1
3_SERVMOD: R290.2 ; port SERVMOD.3_SERVMOD
3SERVMOD: IC4.AN2(IO_L3N_T0_DQS_32) R290.1
4_SERVMOD: R274.2 ; port SERVMOD.4_SERVMOD
4SERVMOD: IC4.AK1(IO_L2N_T0_32) R274.1
5_SERVMOD: R275.2 ; port SERVMOD.5_SERVMOD
5SERVMOD: IC4.AM2(IO_L3P_T0_DQS_32) R275.1
6_SERVMOD: R257.2 ; port SERVMOD.6_SERVMOD
6SERVMOD: IC4.AK2(IO_L2P_T0_32) R257.1
7_SERVMOD: R146.2 ; port SERVMOD.7_SERVMOD
7SERVMOD: IC4.AK3(IO_L6P_T0_32) R146.1
8_SERVMOD: R291.2 ; port SERVMOD.8_SERVMOD
8SERVMOD: IC4.AL2(IO_L4P_T0_32) R291.1
Coaxpress_ret: IC4.AJ10(IO_L19P_T3_32) ; port Coaxpress_ret
DIOT_I2C_SCL: IC4.AL5(IO_L11P_T1_SRCC_32) ; port DIOT_I2C.SCL  [project net DIOT_I2C.SCL]
DIOT_I2C_SDA: IC4.AM5(IO_L11N_T1_SRCC_32) ; port DIOT_I2C.SDA  [project net DIOT_I2C.SDA]
EEPROM_SCL: IC4.AN11(IO_L22N_T3_32) ; port I2C_EEPROM.SCL
EEPROM_SDA: IC4.AM11(IO_L22P_T3_32) ; port I2C_EEPROM.SDA
F_IO0: IC4.AM6(IO_L14N_T2_SRCC_32) ; port MON-bus.F_IO0
F_IO1: IC4.AL9(IO_L21P_T3_DQS_32) ; port MON-bus.F_IO1
F_RST: IC4.AM10(IO_L24N_T3_32) ; port MON-bus.F_RST
I2C_SW_SCL: IC4.AP10(IO_L20N_T3_32) ; port I2C_SW.SCL
I2C_SW_SDA: IC4.AP11(IO_L20P_T3_32) ; port I2C_SW.SDA
M_SCL: IC4.AM7(IO_L14P_T2_SRCC_32) ; port MON-bus.M_SCL
M_SDA: IC4.AL8(IO_25_32) ; port MON-bus.M_SDA
P_IO0: IC4.AK10(IO_L19N_T3_VREF_32) ; port MON-bus.P_IO0  [project net MON-bus.P_IO0]
P_IO1: IC4.AM9(IO_L21N_T3_DQS_32) ; port MON-bus.P_IO1  [project net MON-bus.P_IO1]
P_IO2: IC4.AL10(IO_L24P_T3_32) ; port MON-bus.P_IO2  [project net MON-bus.P_IO2]
P_PRES0_N: IC4.AP9(IO_L18N_T2_32) R85.1 ; port MON-bus.P_PRES0_N  [project net MON-bus.P_PRES0_N]
P_PRES1_N: IC4.AN9(IO_L18P_T2_32) R92.1 ; port MON-bus.P_PRES1_N  [project net MON-bus.P_PRES1_N]
P_RST: IC4.AK7(IO_L13P_T2_MRCC_32) ; port MON-bus.P_RST  [project net MON-bus.P_RST]
PCIe_rst: IC4.AJ11(IO_L23P_T3_32) ; port PCIe_CTRL.PCIe_rst
PCIe_Wake: IC4.AJ9(IO_0_32) ; port PCIe_CTRL.PCIe_Wake
PRST_N: IC4.AP6(IO_L9P_T1_DQS_32) R73.1 ; port DIOT_BUS_CTRL.PRST_N  [project net DIOT_BUS_CTRL.PRST_N]
PS_ON_N: R258.1 T23.1(G) T24.3(D) ; port DIOT_BUS_CTRL.PS_ON_N  [project net DIOT_BUS_CTRL.PS_ON_N]
PWR_Cycle_REQ: IC4.AM1(IO_L4N_T0_32) R261.2 T5.1(G)
PWR_FAIL_N: IC4.AN8(IO_L16P_T2_32) R84.1 ; port DIOT_BUS_CTRL.PWR_FAIL_N  [project net DIOT_BUS_CTRL.PWR_FAIL_N]
PWRBTN_N: IC4.AP8(IO_L16N_T2_32) R83.1 ; port DIOT_BUS_CTRL.PWRBTN_N  [project net DIOT_BUS_CTRL.PWRBTN_N]
RST_N: R75.1 R292.2 ; port DIOT_BUS_CTRL.RST_N  [project net DIOT_BUS_CTRL.RST_N]
SHARED_BUS_0: IC4.AP4(IO_L7N_T1_32) R76.1
SHARED_BUS_1: IC4.AN7(IO_L17P_T2_32) R77.1
SHARED_BUS_2: IC4.AN3(IO_L5P_T0_32) R78.1
SHARED_BUS_3: IC4.AN6(IO_L17N_T2_32) R79.1
SHARED_BUS_4: IC4.AP5(IO_L9N_T1_DQS_32) R81.1
SLOT6.LVDS_0_N: IC4.H28(IO_L12N_T1_MRCC_16)
SLOT6.LVDS_0_P: IC4.J28(IO_L12P_T1_MRCC_16)
SLOT6.LVDS_1_N: IC4.K27(IO_L9N_T1_DQS_16)
SLOT6.LVDS_1_P: IC4.L27(IO_L9P_T1_DQS_16)
SLOT6.LVDS_2_N: IC4.J34(IO_L20N_T3_16)
SLOT6.LVDS_2_P: IC4.K33(IO_L20P_T3_16)
SLOT6.LVDS_3_N: IC4.L30(IO_L18N_T2_16)
SLOT6.LVDS_3_P: IC4.L29(IO_L18P_T2_16)
SLOT6.LVDS_4_N: IC4.J30(IO_L14N_T2_SRCC_16)
SLOT6.LVDS_4_P: IC4.K30(IO_L14P_T2_SRCC_16)
SLOT6.LVDS_5_N: IC4.L24(IO_L1N_T0_16)
SLOT6.LVDS_5_P: IC4.M24(IO_L1P_T0_16)
SLOT6.LVDS_6_N: IC4.H34(IO_L23N_T3_16)
SLOT6.LVDS_6_P: IC4.J33(IO_L23P_T3_16)
SLOT6.LVDS_7_N: IC4.G30(IO_L15N_T2_DQS_16)
SLOT6.LVDS_7_P: IC4.G29(IO_L15P_T2_DQS_16)
SLOT6.LVDS_8_N: IC4.H29(IO_L13N_T2_MRCC_16)
SLOT6.LVDS_8_P: IC4.J29(IO_L13P_T2_MRCC_16)
SLOT6.LVDS_9_N: IC4.G27(IO_L7N_T1_16)
SLOT6.LVDS_9_P: IC4.H27(IO_L7P_T1_16)
SLOT6.LVDS_10_N: IC4.G32(IO_L19N_T3_VREF_16)
SLOT6.LVDS_10_P: IC4.H32(IO_L19P_T3_16)
SLOT6.LVDS_11_N: IC4.H24(IO_L6N_T0_VREF_16)
SLOT6.LVDS_11_P: IC4.J24(IO_L6P_T0_16)
SLOT6.LVDS_12_N: IC4.J26(IO_L10N_T1_16)
SLOT6.LVDS_12_P: IC4.K26(IO_L10P_T1_16)
SLOT6.LVDS_13_N: IC4.G34(IO_L21N_T3_DQS_16)
SLOT6.LVDS_13_P: IC4.H33(IO_L21P_T3_DQS_16)
SLOT6.LVDS_14_N: IC4.G31(IO_L17N_T2_16)
SLOT6.LVDS_14_P: IC4.H31(IO_L17P_T2_16)
SLOT6.LVDS_15_N: IC4.L34(IO_L24N_T3_16)
SLOT6.LVDS_15_P: IC4.L33(IO_L24P_T3_16)
SLOT7.LVDS_0_N: IC4.K6(IO_L11N_T1_SRCC_36)
SLOT7.LVDS_0_P: IC4.K7(IO_L11P_T1_SRCC_36)
SLOT7.LVDS_1_N: IC4.G11(IO_L4N_T0_36)
SLOT7.LVDS_1_P: IC4.H11(IO_L4P_T0_36)
SLOT7.LVDS_2_N: IC4.K8(IO_L9N_T1_DQS_36)
SLOT7.LVDS_2_P: IC4.L8(IO_L9P_T1_DQS_36)
SLOT7.LVDS_3_N: IC4.G9(IO_L2N_T0_36)
SLOT7.LVDS_3_P: IC4.G10(IO_L2P_T0_36)
SLOT7.LVDS_4_N: IC4.J11(IO_L3N_T0_DQS_36)
SLOT7.LVDS_4_P: IC4.K11(IO_L3P_T0_DQS_36)
SLOT7.LVDS_5_N: IC4.K12(IO_L1N_T0_36)
SLOT7.LVDS_5_P: IC4.L12(IO_L1P_T0_36)
SLOT7.LVDS_6_N: IC4.J8(IO_L7N_T1_36)
SLOT7.LVDS_6_P: IC4.J9(IO_L7P_T1_36)
SLOT7.LVDS_7_N: IC4.G6(IO_L10N_T1_36)
SLOT7.LVDS_7_P: IC4.G7(IO_L10P_T1_36)
SLOT7.LVDS_8_N: IC4.G4(IO_L13N_T2_MRCC_36)
SLOT7.LVDS_8_P: IC4.G5(IO_L13P_T2_MRCC_36)
SLOT7.LVDS_9_N: IC4.J10(IO_L6N_T0_VREF_36)
SLOT7.LVDS_9_P: IC4.K10(IO_L6P_T0_36)
SLOT7.LVDS_10_N: IC4.H8(IO_L8N_T1_36)
SLOT7.LVDS_10_P: IC4.H9(IO_L8P_T1_36)
SLOT7.LVDS_11_N: IC4.G2(IO_L20N_T3_36)
SLOT7.LVDS_11_P: IC4.H2(IO_L20P_T3_36)
SLOT7.LVDS_12_N: IC4.H3(IO_L17N_T2_36)
SLOT7.LVDS_12_P: IC4.H4(IO_L17P_T2_36)
SLOT7.LVDS_13_N: IC4.J1(IO_L21N_T3_DQS_36)
SLOT7.LVDS_13_P: IC4.K1(IO_L21P_T3_DQS_36)
SLOT7.LVDS_14_N: IC4.F2(IO_L15N_T2_DQS_36)
SLOT7.LVDS_14_P: IC4.F3(IO_L15P_T2_DQS_36)
SLOT7.LVDS_15_N: IC4.L9(IO_L5N_T0_36)
SLOT7.LVDS_15_P: IC4.L10(IO_L5P_T0_36)
SLOT8.LVDS_0_N: IC4.K28(IO_L11N_T1_SRCC_16)
SLOT8.LVDS_0_P: IC4.L28(IO_L11P_T1_SRCC_16)
SLOT8.LVDS_1_N: IC4.J25(IO_L4N_T0_16)
SLOT8.LVDS_1_P: IC4.K25(IO_L4P_T0_16)
SLOT8.LVDS_2_N: IC4.L25(IO_L5N_T0_16)
SLOT8.LVDS_2_P: IC4.M25(IO_L5P_T0_16)
SLOT8.LVDS_3_N: IC4.K32(IO_L22N_T3_16)
SLOT8.LVDS_3_P: IC4.L32(IO_L22P_T3_16)
SLOT8.LVDS_4_N: IC4.J31(IO_L16N_T2_16)
SLOT8.LVDS_4_P: IC4.K31(IO_L16P_T2_16)
SLOT8.LVDS_5_N: IC4.G25(IO_L3N_T0_DQS_16)
SLOT8.LVDS_5_P: IC4.G24(IO_L3P_T0_DQS_16)
SLOT8.LVDS_6_N: IC4.G26(IO_L8N_T1_16)
SLOT8.LVDS_6_P: IC4.H26(IO_L8P_T1_16)
SLOT8.LVDS_7_N: IC4.J23(IO_L2N_T0_16)
SLOT8.LVDS_7_P: IC4.K23(IO_L2P_T0_16)
SLOT8.LVDS_8_N: IC4.H6(IO_L12N_T1_MRCC_36)
SLOT8.LVDS_8_P: IC4.H7(IO_L12P_T1_MRCC_36)
SLOT8.LVDS_9_N: IC4.L3(IO_L19N_T3_VREF_36)
SLOT8.LVDS_9_P: IC4.L4(IO_L19P_T3_36)
SLOT8.LVDS_10_N: IC4.J5(IO_L14N_T2_SRCC_36)
SLOT8.LVDS_10_P: IC4.J6(IO_L14P_T2_SRCC_36)
SLOT8.LVDS_11_N: IC4.L2(IO_L23N_T3_36)
SLOT8.LVDS_11_P: IC4.M2(IO_L23P_T3_36)
SLOT8.LVDS_12_N: IC4.K2(IO_L24N_T3_36)
SLOT8.LVDS_12_P: IC4.K3(IO_L24P_T3_36)
SLOT8.LVDS_13_N: IC4.J3(IO_L18N_T2_36)
SLOT8.LVDS_13_P: IC4.J4(IO_L18P_T2_36)
SLOT8.LVDS_14_N: IC4.G1(IO_L22N_T3_36)
SLOT8.LVDS_14_P: IC4.H1(IO_L22P_T3_36)
SLOT8.LVDS_15_N: IC4.K5(IO_L16N_T2_36)
SLOT8.LVDS_15_P: IC4.L5(IO_L16P_T2_36)
SYSEN_N: IC4.AP3(IO_L5N_T0_32) ; port SYSEN_N
UART.CTS1: IC4.AL4(IO_L10P_T1_32) ; port UART1.CTS
UART.CTS2: IC4.AK8(IO_L15N_T2_DQS_32) ; port UART2.CTS
UART.RTS1: IC4.AL3(IO_L6N_T0_VREF_32) ; port UART1.RTS
UART.RTS2: IC4.AJ8(IO_L15P_T2_DQS_32) ; port UART2.RTS
UART.RX1: IC4.AK6(IO_L12N_T1_MRCC_32) ; port UART1.RX
UART.RX2: IC4.AL7(IO_L13N_T2_MRCC_32) ; port UART2.RX
UART.TX1: IC4.AK5(IO_L8N_T1_32) ; port UART1.TX
UART.TX2: IC4.AJ6(IO_L12P_T1_MRCC_32) ; port UART2.TX
NetC397_1: C397.1 R93.1 R260.1 T24.1(G)
NetC398_1: C398.1 R259.1 T5.3(D) T23.3(D)
NetC398_2: C398.2 R260.2
NetIC4_AN4: IC4.AN4(IO_L7P_T1_32) R292.1

Not connected (* = marked no-connect by the designer): IC4 AJ5(IO_L8P_T1_32)* AK11(IO_L23N_T3_32)* AM4(IO_L10N_T1_32)* H12(IO_0_36)* L7(IO_25_36)* L23(IO_0_16)* M26(IO_25_16)*

### Buses and harness runs
harness SLOT6 = port SLOT6
harness SLOT7 = port SLOT7
harness SLOT8 = port SLOT8

### Layout directives
net class D100: SLOT6, SLOT7, SLOT8

### Notes on the sheet
- (near IC4) 3V3
- Clock Capable
- Crate power cycle timer
- Project/Equipment
- Document
- Designer
- Drawn by
- Check.by
- Copyright WUT ISE 2024.
  This documentation describes Open Hardware and is licensed under the CERN OHL-W v.2.0. You may redistribute and modify this documentation under the terms of the CERN OHL-W v.2.0. (http://ohwr.org/CERNOHL). This documentation is distributed WITHOUT ANY EXPRESS OR IMPLIED WARRANTY, INCLUDING OF MERCHANTABILITY, SATISFACTORY QUALITY AND FITNESS FOR A PARTICULAR PURPOSE. Please see the CERN OHL v.2.0 for applicable conditions.
- Contact
- File
- Last Mod.
- Print Date
- Sheet
- Size
- A3
- of
- Rev
- (in symbol R0402_1K_1%_0.0625W_100PPM) 1%
- (in symbol R0402_4K7_1%_0.0625W_100PPM) 1%
- (in symbol R0402_10K_1%_0.0625W_100PPM) 1%
- (in symbol XC7A200T-3FFG1156C, part E) BANK 16
- (in symbol XC7A200T-3FFG1156C, part F) BANK 32
- (in symbol XC7A200T-3FFG1156C, part J) BANK 36

### Library data of the parts
C397 = CC0402_100NF_16V_10%_X7R: as C213-C224 on sheet USB_Serial_Quad; Part Number: CC0402_100NF_16V_10%_X7R; Component Kind: Standard; Component Type: Standard; Pin Count: 2; Value: 100nF; Status: Not Recommended; Manufacturer Part Number: CC0402_100NF_16V_10%_X7R; Case: 0402; Mounted: Yes; Socket: No; SMD: Yes; Sense: No; Manufacturer1 Example: MURATA; Manufacturer1 ComponentHeight: 0.55mm; HelpURL: \\cern.ch\dfs\Applications\Altium\Datasheets\CC0402_X7R_MURATA_GRM.pdf; Author: CERN DEM JLC; CreateDate: 05/12/2013; LatestRevisionDate: 03/12/2007
C398 = CC1206_10UF_25V_10%_X7R: Non-polarised capacitor; Part Description: SMD Multilayer Chip Ceramic Capacitor; Manufacturer: GENERIC; Manufacturer1 Part Number: C1206C106K4RACTU; Voltage: 25V; TC: X7R; Tolerance: ±10%; Part Number: CC1206_10UF_25V_10%_X7R; Component Kind: Standard; Component Type: Standard; Pin Count: 2; Value: 10uF; Status: Preferred; Manufacturer Part Number: CC1206_10UF_25V_10%_X7R; Case: 1206; Mounted: Yes; Socket: No; SMD: Yes; Sense: No; Manufacturer1 Example: KEMET; Manufacturer1 ComponentHeight: 1.8mm; HelpURL: \\cern.ch\dfs\Applications\Altium\Datasheets\CC1206_X7R_KEMET.pdf; Author: CERN DEM JLC; CreateDate: 12/09/2012; LatestRevisionDate: 12/09/2012
IC4 = XC7A200T-3FFG1156C: as IC4 on sheet Bank_13_15; Part Number: XC7A200T-3FFG1156C; Component Kind: Standard; Component Type: Standard; Device: XC7A200T-3FFG1156C; PackageDescription: BGA, 1.00mm Pitch, Square; 1156 Pin, 34 Columns X 34 Rows, Body 35.00mm X 35.0mm X 3.10mm H, IPC Medium Density; Manufacturer Part Number: XC7A200T-3FFG1156C; Pin Count: 1156; Case: BGA1156; Mounted: Yes; Socket: No; SMD: Yes; Sense: No; ComponentHeight: 3.1mm; HelpURL: \\cern.ch\dfs\Applications\Altium\Datasheets\XC7A200T-3FFG1156C.pdf; ComponentLink1URL: \\cern.ch\dfs\Applications\Altium\Datasheets\XC7A200T-3FFG1156C_Package.pdf; ComponentLink1Description: Package; ComponentLink2URL: \\cern.ch\dfs\Applications\Altium\Datasheets\XC7A200T-3FFG1156C_Pinout.txt; ComponentLink2Description: Pinout; Author: CERN DEM JLC; CreateDate: 07.11.2016; LatestRevisionDate: 07.11.2016
R73 R83 R84 = R0402_4K7_1%_0.0625W_100PPM: Resistor - 1%; Part Description: General Purpose Thick Film Chip Resistor; Manufacturer: GENERIC; Manufacturer1 Part Number: 232270674702L; TC: ±100ppm/°C; PressFit: No; Part Number: R0402_4K7_1%_0.0625W_100PPM; Component Kind: Standard; Component Type: Standard; Pin Count: 2; Value: 4k7; Status: Not Recommended; Power: 0.0625W; Tolerance: ±1%; Manufacturer Part Number: R0402_4K7_1%_0.0625W_100PPM; Case: 0402; Mounted: Yes; Sense: No; Socket: No; SMD: Yes; Manufacturer1 Example: YAGEO PHYCOMP; Manufacturer1 ComponentHeight: 0.4mm; HelpURL: \\cern.ch\dfs\Applications\Altium\Datasheets\R0402_Phycomp_RC0402.pdf; Author: CERN DEM JLC; CreateDate: 03-Dec-07; LatestRevisionDate: 17-Oct-12
R75-R79 R81 R85 R92 R260 R261 = R0402_10K_1%_0.0625W_100PPM: as R194-R198 on sheet USB_Serial_Quad; Part Number: R0402_10K_1%_0.0625W_100PPM; Component Kind: Standard; Component Type: Standard; Pin Count: 2; Value: 10k; Status: Not Recommended; Power: 0.0625W; Tolerance: ±1%; Manufacturer Part Number: R0402_10K_1%_0.0625W_100PPM; Case: 0402; Mounted: Yes; Sense: No; Socket: No; SMD: Yes; Manufacturer1 Example: YAGEO PHYCOMP; Manufacturer1 ComponentHeight: 0.4mm; HelpURL: \\cern.ch\dfs\Applications\Altium\Datasheets\R0402_Phycomp_RC0402.pdf; Author: CERN DEM JLC
  R75-R79 R81 R85 R92: CreateDate: 03.12.2007; LatestRevisionDate: 17.10.2012
  R260 R261: CreateDate: 03/12/2007; LatestRevisionDate: 17/10/2012
R93 = R0402_210K_1%_0.063W_100PPM: Resistor - 1%; Part Description: General Purpose Thick Film Chip Resistor; Manufacturer: GENERIC; Manufacturer1 Part Number: CRCW0402210KFK; Power: 0.063W; TC: ±100ppm/°C; PressFit: No; Part Number: R0402_210K_1%_0.063W_100PPM; Component Kind: Standard; Component Type: Standard; Pin Count: 2; Value: 210k; Status: None; Manufacturer Part Number: R0402_210K_1%_0.063W_100PPM; Case: 0402; Mounted: Yes; Sense: No; Socket: No; SMD: Yes; Manufacturer1 Example: VISHAY; Manufacturer1 ComponentHeight: 0.4mm; HelpURL: \\cern.ch\dfs\Applications\Altium\Datasheets\R0402_VISHAY_CRCW e3.pdf; Author: CERN DEM BC; CreateDate: 08/02/2021; LatestRevisionDate: 08/02/2021
R146 R239 R249 R257 R274 R275 R290-R292 = R0402_0R_JUMPER: Resistor; Part Description: 1A (0.05R Max DC Resistance) Zero Ohm Jumper; Manufacturer: GENERIC; Manufacturer1 Part Number: 232270591001L; PressFit: No; Part Number: R0402_0R_JUMPER; Component Kind: Standard; Component Type: Standard; Pin Count: 2; Value: 0; Status: Not Recommended; Manufacturer Part Number: R0402_0R_JUMPER; Case: 0402; Mounted: Yes; Sense: No; Socket: No; SMD: Yes; Manufacturer1 Example: YAGEO PHYCOMP; Manufacturer1 ComponentHeight: 0.4mm; HelpURL: \\cern.ch\dfs\Applications\Altium\Datasheets\R0402_Phycomp_RC0402.pdf; Author: CERN DEM JLC; CreateDate: 03.12.2007; LatestRevisionDate: 17.10.2012
R258 R259 = R0402_1K_1%_0.0625W_100PPM: Resistor - 1%; Part Description: General Purpose Thick Film Chip Resistor; Manufacturer: GENERIC; Manufacturer1 Part Number: 232270671002L; TC: ±100ppm/°C; PressFit: No; Part Number: R0402_1K_1%_0.0625W_100PPM; Component Kind: Standard; Component Type: Standard; Pin Count: 2; Value: 1k; Status: Not Recommended; Power: 0.0625W; Tolerance: ±1%; Manufacturer Part Number: R0402_1K_1%_0.0625W_100PPM; Case: 0402; Mounted: Yes; Sense: No; Socket: No; SMD: Yes; Manufacturer1 Example: YAGEO PHYCOMP; Manufacturer1 ComponentHeight: 0.4mm; HelpURL: \\cern.ch\dfs\Applications\Altium\Datasheets\R0402_Phycomp_RC0402.pdf; Author: CERN DEM JLC; CreateDate: 03/12/2007; LatestRevisionDate: 17/10/2012
T5 T23 T24 = BSS138LT1G: N-CHANNEL MOSFET WITH DIODE; Part Description: 50V, 200mA N-Channel Enhancement Mode Field-Effect Transistor; Manufacturer: ON SEMICONDUCTOR; PressFit: No; Bonding: No; Part Number: BSS138LT1G; Component Kind: Standard; Component Type: Standard; Device: BSS138LT1G; PackageDescription: SOT23, 0.95mm Pitch; 3 Pin, 1.40mm W X 3.00mm L X 1.10mm H body, IPC Medium Density; Manufacturer Part Number: BSS138L; Pin Count: 3; Case: SOT23-3; Mounted: Yes; Socket: No; SMD: Yes; Sense: No; ComponentHeight: 1.11mm; HelpURL: \\cern.ch\dfs\Applications\Altium\Datasheets\BSS138LT1G.pdf; Author: CERN DEM JLC; CreateDate: 23/03/2009; LatestRevisionDate: 25/05/2022